# Altium schematic sheet MacroPlay.SchDoc
size A4; DocumentNumber: 6; SheetNumber: 6; SheetTotal: 6
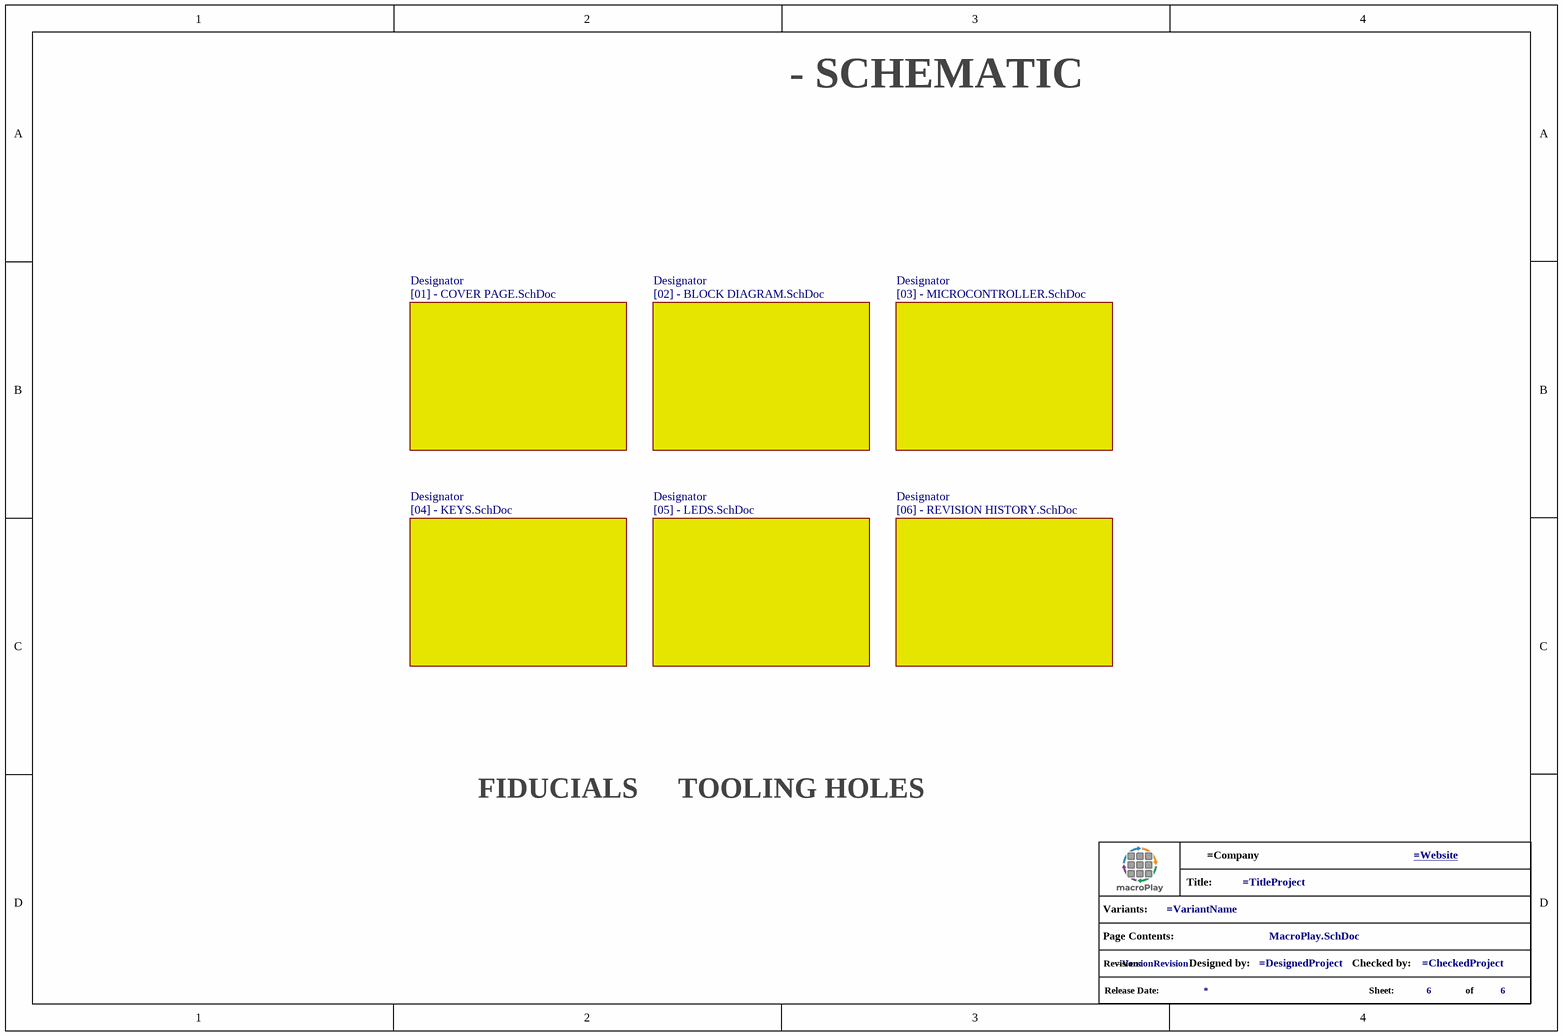
[diagram p0: MacroPlay.SchDoc]

## Parts
*?  info_project  (value not drawn)  (graphical)

## Sub-sheets
Designator = [02] - BLOCK DIAGRAM.SchDoc: no entries
Designator = [03] - MICROCONTROLLER.SchDoc: no entries
Designator = [01] - COVER PAGE.SchDoc: no entries
Designator = [06] - REVISION HISTORY.SchDoc: no entries
Designator = [04] - KEYS.SchDoc: no entries
Designator = [05] - LEDS.SchDoc: no entries

## Notes on the sheet
- - SCHEMATIC
- FIDUCIALS
- TOOLING HOLES
- (in symbol info_project) Title:; Variants:; Page Contents:; Revision:; Designed by:; Checked by:; Release Date:; Sheet:; of

## Library data of the parts
*? = info_project: GRAPHICAL - Info Project